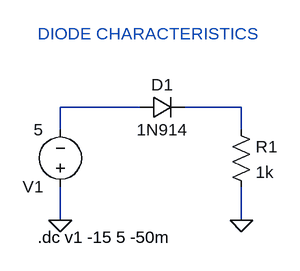
[diagram p0: schematic 5)diode_characteristics.asc]
5)diode_characteristics.asc, the LTspice schematic file:
Version 4
SHEET 1 880 680
WIRE 176 80 64 80
WIRE 320 80 240 80
WIRE 64 112 64 80
WIRE 320 112 320 80
WIRE 64 240 64 192
WIRE 320 240 320 192
FLAG 64 240 0
FLAG 320 240 0
SYMBOL voltage 64 208 R180
WINDOW 123 0 0 Left 0
WINDOW 39 0 0 Left 0
SYMATTR InstName V1
SYMATTR Value 5
SYMBOL res 304 96 R0
SYMATTR InstName R1
SYMATTR Value 1k
SYMBOL diode 176 96 R270
WINDOW 0 32 32 VTop 2
WINDOW 3 0 32 VBottom 2
SYMATTR InstName D1
SYMATTR Value 1N914
TEXT 32 264 Left 2 !.dc v1 -15 5 -50m
TEXT 32 -24 Left 2 ;DIODE CHARACTERISTICS

The netlist it stands for:
* 5)diode_characteristics.asc
V1 0 N001 5
R1 N002 0 1k
D1 N001 N002 1N914
.model D D
.lib standard.dio
.dc v1 -15 5 -50m
* DIODE CHARACTERISTICS
.backanno
.end